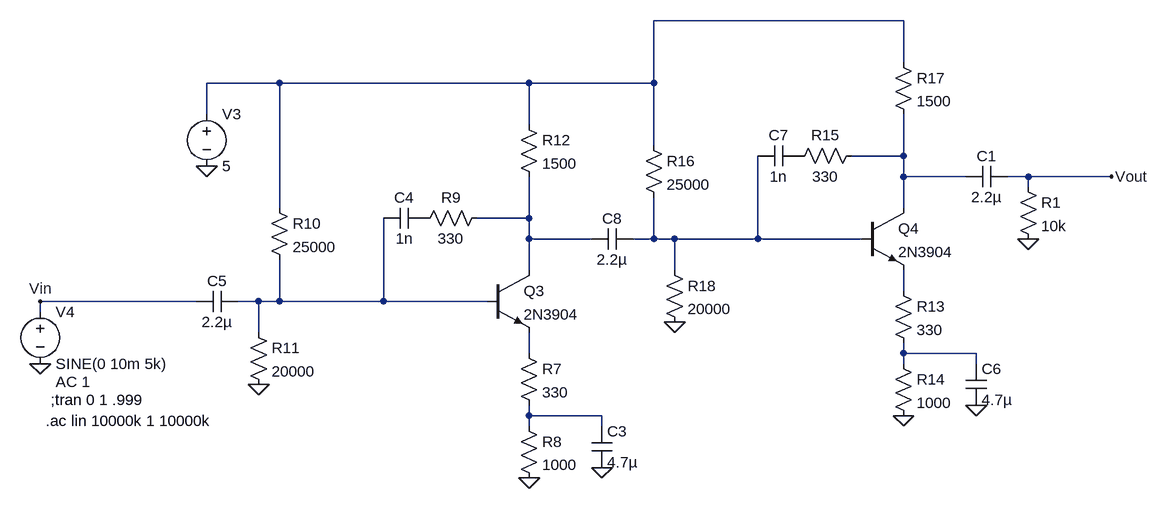
[diagram p0: schematic 04B-345.asc]
04B-345.asc, the LTspice schematic file:
Version 4
SHEET 1 2376 680
WIRE 1984 -160 1600 -160
WIRE 1984 -96 1984 -160
WIRE 1024 -64 912 -64
WIRE 1408 -64 1024 -64
WIRE 1600 -64 1600 -160
WIRE 1600 -64 1408 -64
WIRE 912 -16 912 -64
WIRE 1408 0 1408 -64
WIRE 1600 32 1600 -64
WIRE 1984 48 1984 -16
WIRE 1984 48 1904 48
WIRE 1984 80 1984 48
WIRE 2080 80 1984 80
WIRE 2176 80 2144 80
WIRE 2304 80 2176 80
WIRE 2176 96 2176 80
WIRE 1024 128 1024 -64
WIRE 1984 128 1984 80
WIRE 1408 144 1408 80
WIRE 1408 144 1328 144
WIRE 1408 176 1408 144
WIRE 1504 176 1408 176
WIRE 1600 176 1600 112
WIRE 1600 176 1568 176
WIRE 1632 176 1600 176
WIRE 1760 176 1760 48
WIRE 1760 176 1632 176
WIRE 1920 176 1760 176
WIRE 1408 224 1408 176
WIRE 1632 224 1632 176
WIRE 1984 256 1984 224
WIRE 896 272 656 272
WIRE 992 272 960 272
WIRE 1024 272 1024 208
WIRE 1024 272 992 272
WIRE 1184 272 1184 144
WIRE 1184 272 1024 272
WIRE 1344 272 1184 272
WIRE 656 288 656 272
WIRE 992 320 992 272
WIRE 1408 352 1408 320
WIRE 1984 352 1984 336
WIRE 2096 352 1984 352
WIRE 1984 368 1984 352
WIRE 2096 368 2096 352
WIRE 1408 448 1408 432
WIRE 1520 448 1408 448
WIRE 1408 464 1408 448
WIRE 1520 464 1520 448
FLAG 992 400 0
FLAG 1408 544 0
FLAG 1520 528 0
FLAG 912 64 0
FLAG 656 368 0
FLAG 656 272 Vin
FLAG 1984 448 0
FLAG 2096 432 0
FLAG 1632 304 0
FLAG 2304 80 Vout
FLAG 2176 176 0
SYMBOL npn 1344 224 R0
SYMATTR InstName Q3
SYMATTR Value 2N3904
SYMBOL res 1392 336 R0
SYMATTR InstName R7
SYMATTR Value 330
SYMBOL res 1392 448 R0
SYMATTR InstName R8
SYMATTR Value 1000
SYMBOL cap 1504 464 R0
SYMATTR InstName C3
SYMATTR Value 4.7µ
SYMBOL cap 1248 128 R90
WINDOW 0 0 32 VBottom 2
WINDOW 3 32 32 VTop 2
SYMATTR InstName C4
SYMATTR Value 1n
SYMBOL res 1344 128 R90
WINDOW 0 0 56 VBottom 2
WINDOW 3 32 56 VTop 2
SYMATTR InstName R9
SYMATTR Value 330
SYMBOL res 1008 112 R0
SYMATTR InstName R10
SYMATTR Value 25000
SYMBOL res 976 304 R0
SYMATTR InstName R11
SYMATTR Value 20000
SYMBOL res 1392 -16 R0
SYMATTR InstName R12
SYMATTR Value 1500
SYMBOL voltage 912 -32 R0
WINDOW 123 0 0 Left 0
WINDOW 39 0 0 Left 0
SYMATTR InstName V3
SYMATTR Value 5
SYMBOL voltage 656 272 R0
WINDOW 123 24 124 Left 2
WINDOW 39 0 0 Left 0
SYMATTR Value2 AC 1
SYMATTR InstName V4
SYMATTR Value SINE(0 10m 5k)
SYMBOL cap 960 256 R90
WINDOW 0 0 32 VBottom 2
WINDOW 3 32 32 VTop 2
SYMATTR InstName C5
SYMATTR Value 2.2µ
SYMBOL npn 1920 128 R0
SYMATTR InstName Q4
SYMATTR Value 2N3904
SYMBOL res 1968 240 R0
SYMATTR InstName R13
SYMATTR Value 330
SYMBOL res 1968 352 R0
SYMATTR InstName R14
SYMATTR Value 1000
SYMBOL cap 2080 368 R0
SYMATTR InstName C6
SYMATTR Value 4.7µ
SYMBOL cap 1824 32 R90
WINDOW 0 0 32 VBottom 2
WINDOW 3 32 32 VTop 2
SYMATTR InstName C7
SYMATTR Value 1n
SYMBOL res 1920 32 R90
WINDOW 0 0 56 VBottom 2
WINDOW 3 32 56 VTop 2
SYMATTR InstName R15
SYMATTR Value 330
SYMBOL res 1584 16 R0
SYMATTR InstName R16
SYMATTR Value 25000
SYMBOL res 1968 -112 R0
SYMATTR InstName R17
SYMATTR Value 1500
SYMBOL res 1616 208 R0
SYMATTR InstName R18
SYMATTR Value 20000
SYMBOL cap 1568 160 R90
WINDOW 0 0 32 VBottom 2
WINDOW 3 32 32 VTop 2
SYMATTR InstName C8
SYMATTR Value 2.2µ
SYMBOL cap 2144 64 R90
WINDOW 0 0 32 VBottom 2
WINDOW 3 32 32 VTop 2
SYMATTR InstName C1
SYMATTR Value 2.2µ
SYMBOL res 2160 80 R0
SYMATTR InstName R1
SYMATTR Value 10k
TEXT 672 424 Left 2 !;tran 0 1 .999
TEXT 664 456 Left 2 !.ac lin 10000k 1 10000k

The netlist it stands for:
* 04B-345.asc
Q3 N003 N006 N007 0 2N3904
R7 N007 N009 330
R8 N009 0 1000
C3 N009 0 4.7µ
C4 P001 N006 1n
R9 N003 P001 330
R10 N001 N006 25000
R11 N006 0 20000
R12 N001 N003 1500
V3 N001 0 5
V4 Vin 0 SINE(0 10m 5k) AC 1
C5 N006 Vin 2.2µ
Q4 N002 N004 N005 0 2N3904
R13 N005 N008 330
R14 N008 0 1000
C6 N008 0 4.7µ
C7 P002 N004 1n
R15 N002 P002 330
R16 N001 N004 25000
R17 N001 N002 1500
R18 N004 0 20000
C8 N004 N003 2.2µ
C1 Vout N002 2.2µ
R1 Vout 0 10k
.model NPN NPN
.model PNP PNP
.lib standard.bjt
;tran 0 1 .999
.ac lin 10000k 1 10000k
.backanno
.end